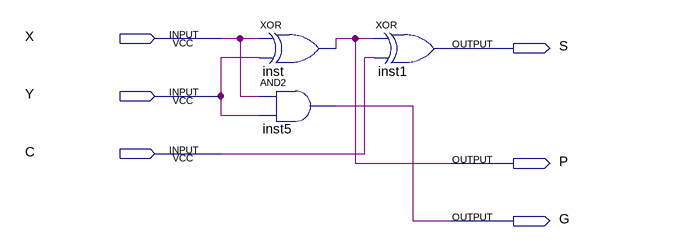
[diagram p0: schematic sheet]
// Quartus schematic PartialFullAdder.bdf as structural Verilog: 3 symbols, 6 pins
module PartialFullAdder (
  input  X,
  input  Y,
  input  C,
  output S,
  output P,
  output G
);

  xor inst (P, X, Y);
  and inst5 (G, X, Y);
  xor inst1 (S, P, C);
endmodule
